# Altium schematic sheet [17] - LVDS, CSI, LCD, TSC.SchDoc
size A2; DocumentNumber: 17; SheetNumber: 17; SheetTotal: 31
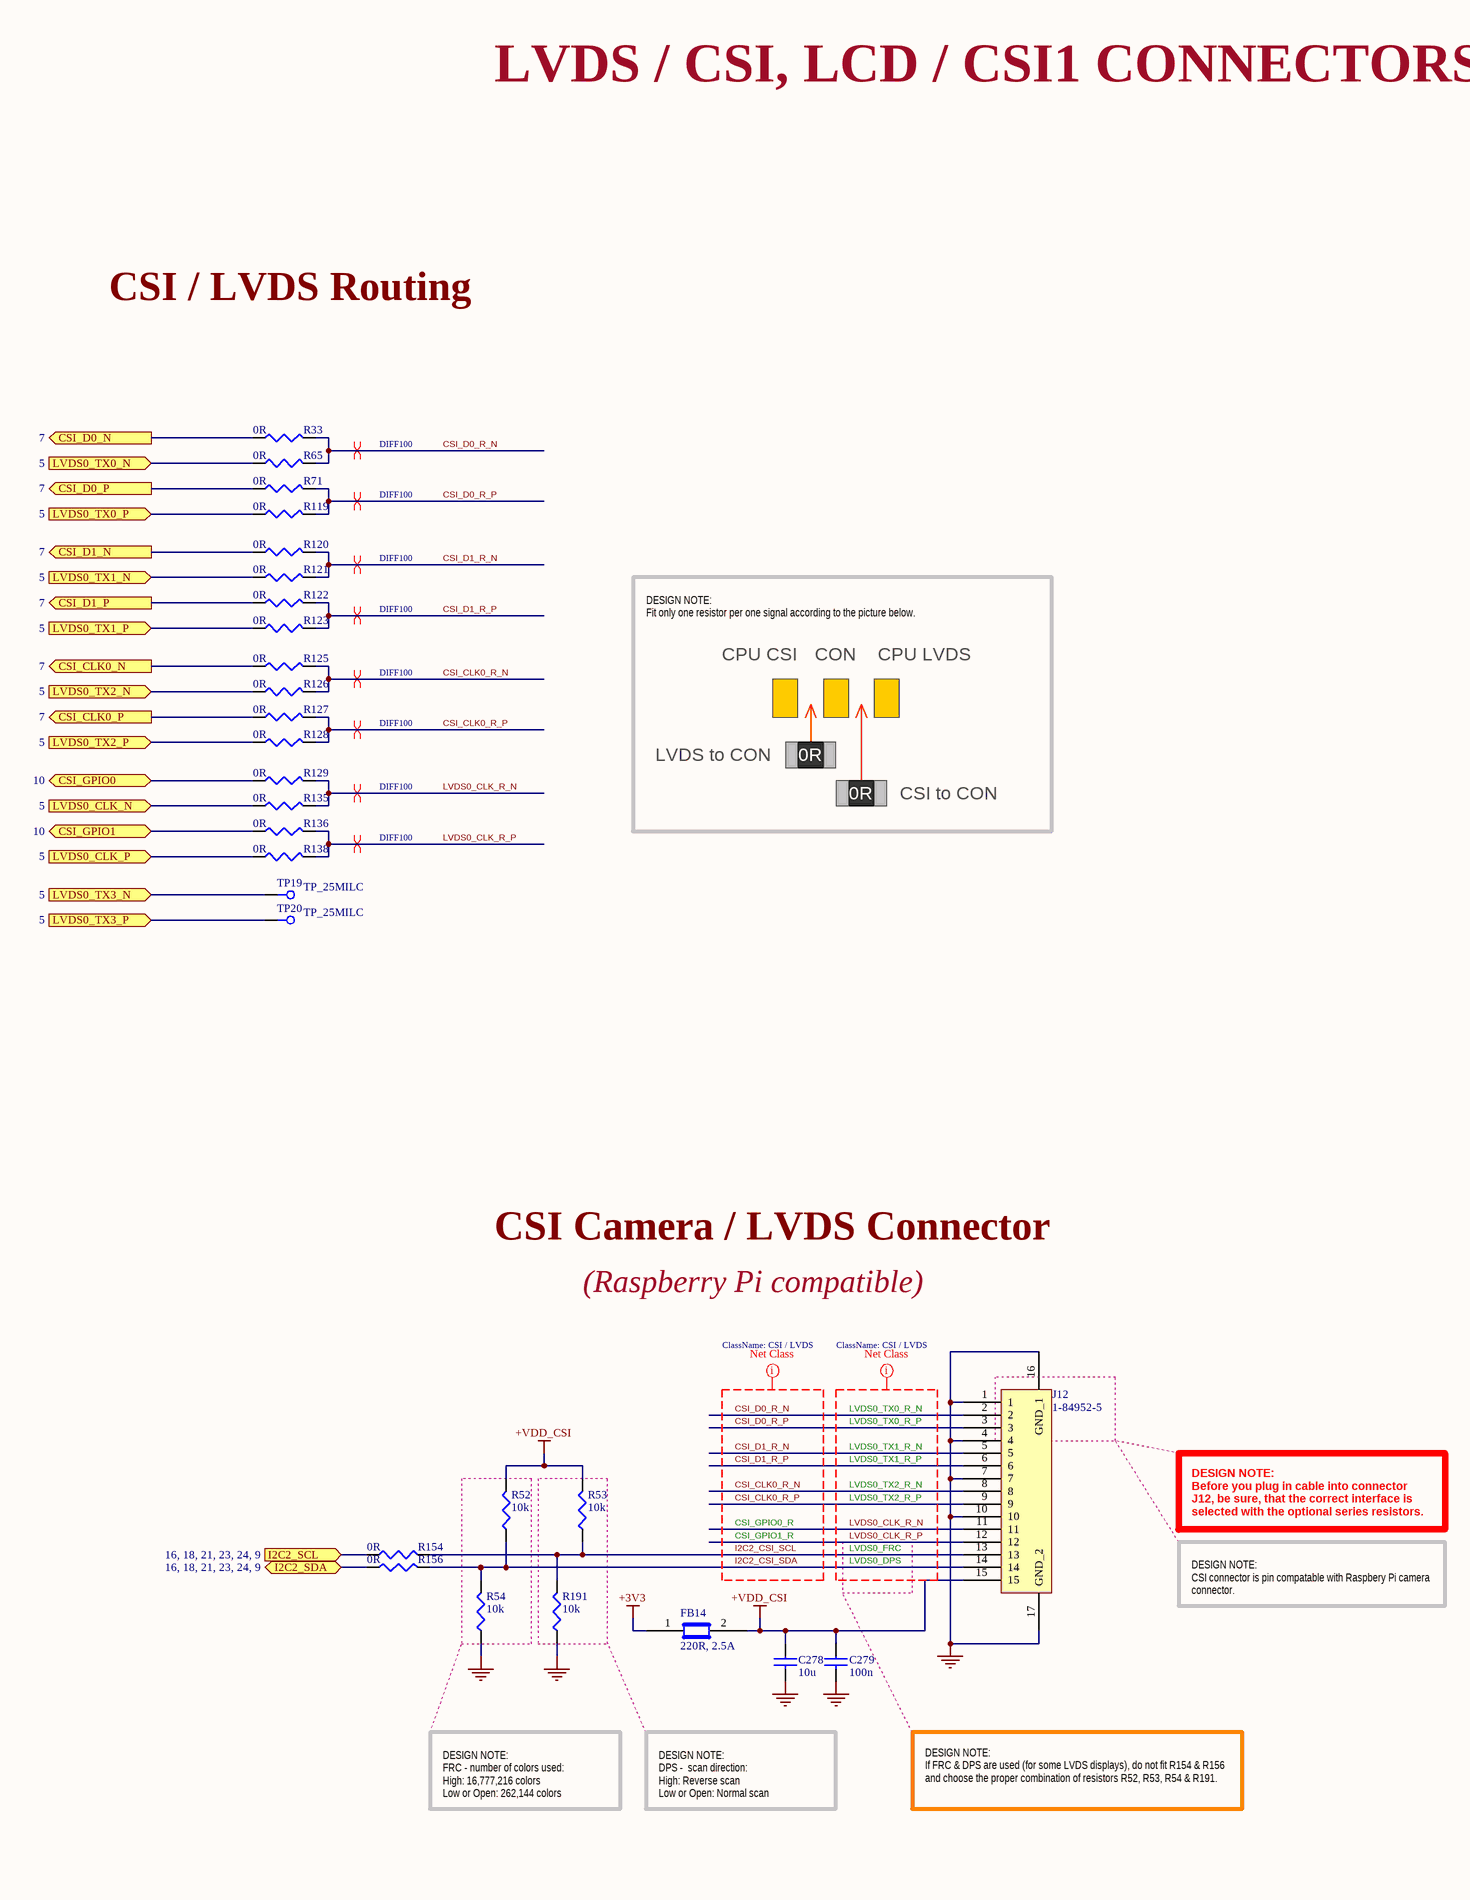
[diagram p0: [17] - LVDS, CSI, LCD, TSC.SchDoc, left]
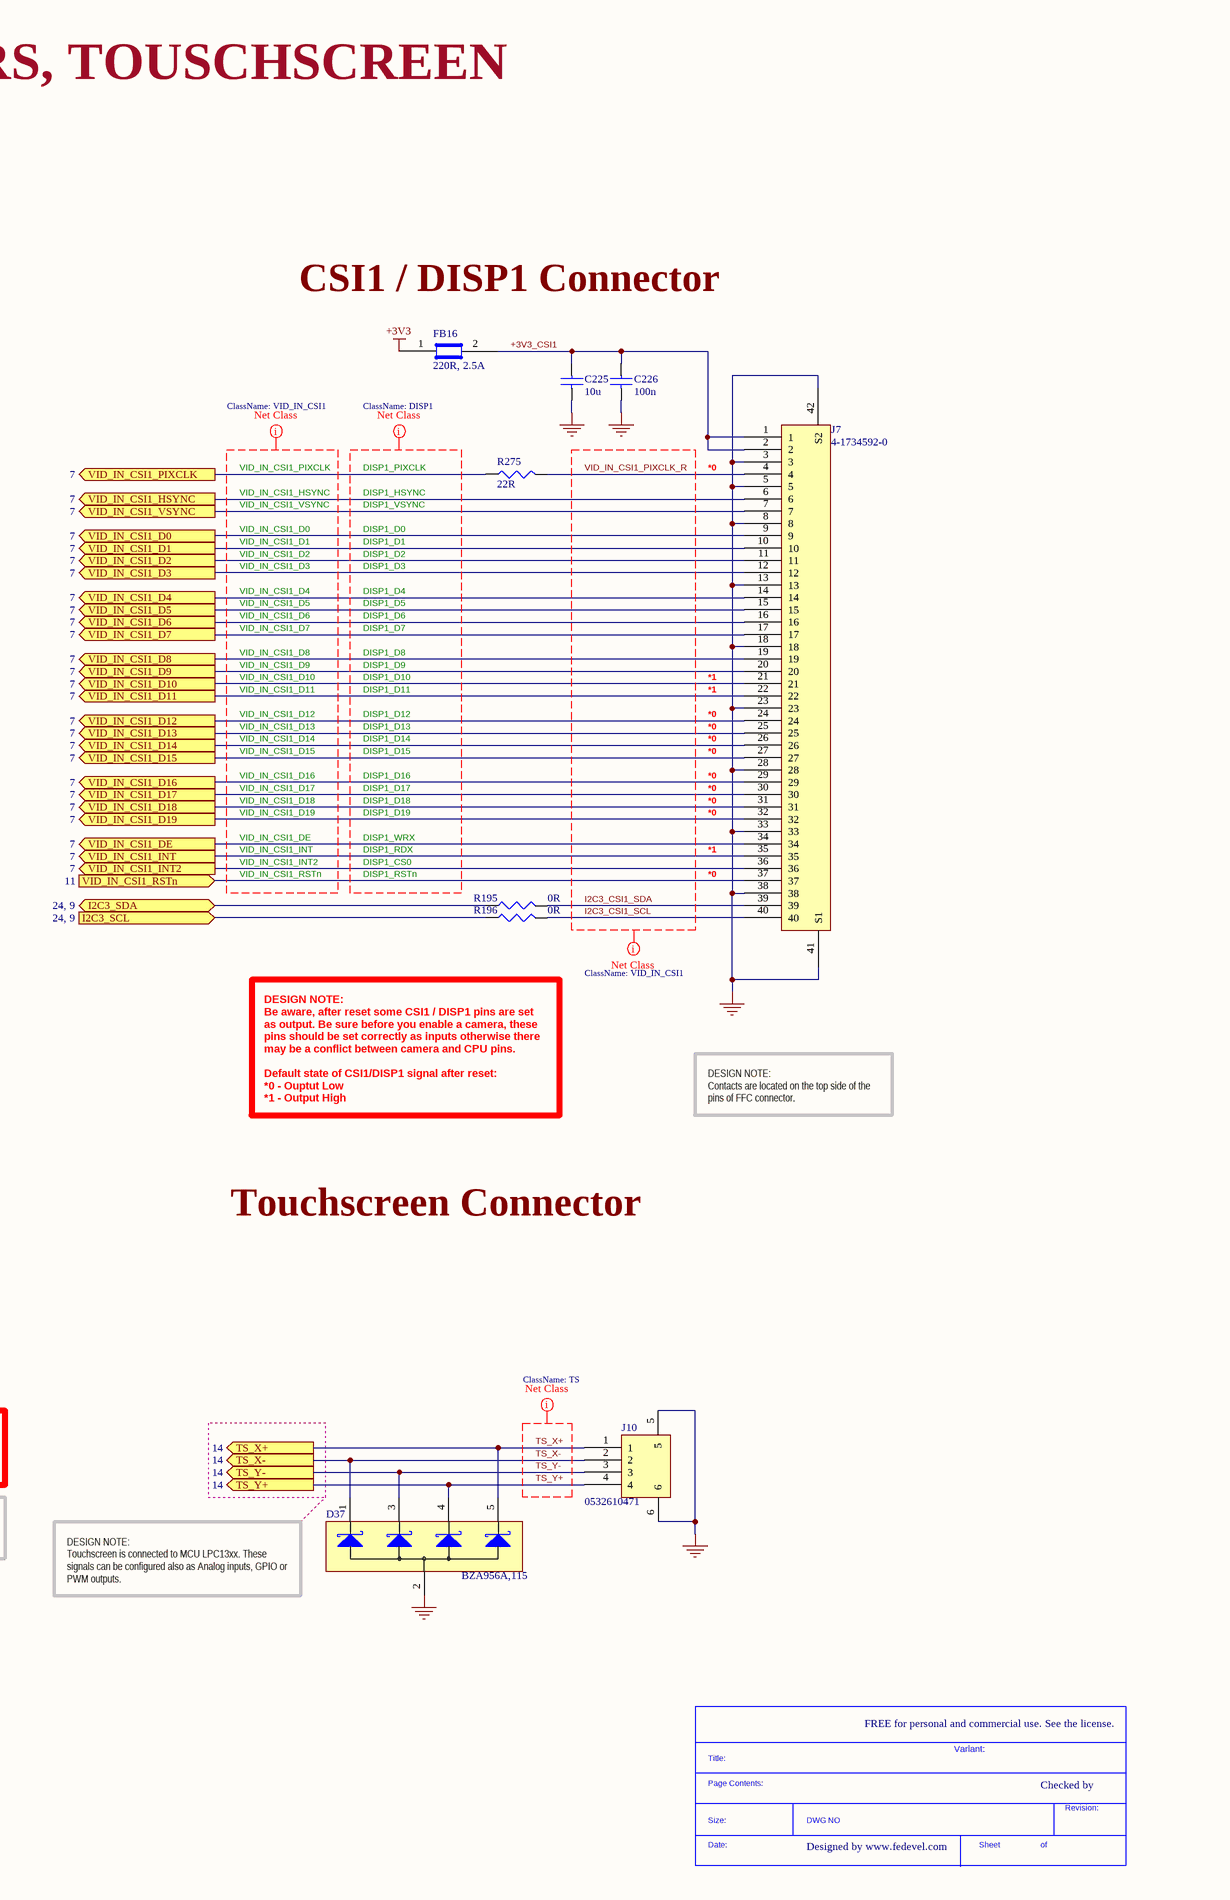
[diagram p1: [17] - LVDS, CSI, LCD, TSC.SchDoc, right]

## Parts
*  SDTitleBlock  (value not drawn)  (graphical)
C225  10u  [C0603]
C226  100n  [C0402]
C278  10u  [C0603]
C279  100n  [C0402]
D37  BZA956A,115  [SOT665]
FB14  220R, 2.5A  [C0603]
FB16  220R, 2.5A  [C0603]
J7  4-1734592-0  [4-1734592-0]
J10  0532610471  [0532610471]
J12  1-84952-5  [ZIF_RA_BOTTOM_15x1mm]
R33  0R  [R0402]
R52  10k  [R0402]
R53  10k  [R0402]
R54  10k  [R0402]
R65  0R  [R0402]
R71  0R  [R0402]
R119  0R  [R0402]
R120  0R  [R0402]
R121  0R  [R0402]
R122  0R  [R0402]
R123  0R  [R0402]
R125  0R  [R0402]
R126  0R  [R0402]
R127  0R  [R0402]
R128  0R  [R0402]
R129  0R  [R0402]
R135  0R  [R0402]
R136  0R  [R0402]
R138  0R  [R0402]
R154  0R  [R0402]
R156  0R  [R0402]
R191  10k  [R0402]
R195  0R  [R0402]
R196  0R  [R0402]
R275  22R  [R0402]
TP19  TP_25MILC  [TP_25C]  (no BOM)
TP20  TP_25MILC  [TP_25C]  (no BOM)

## Ports
CSI_CLK0_N (out, see 7), CSI_CLK0_P (out, see 7), CSI_D0_N (out, see 7), CSI_D0_P (out, see 7), CSI_D1_N (out, see 7), CSI_D1_P (out, see 7), CSI_GPIO0 (bidir, see 10), CSI_GPIO1 (bidir, see 10), I2C2_SCL (see 16, 18, 21, 23, 24, 9), I2C2_SDA (bidir, see 16, 18, 21, 23, 24, 9), I2C3_SCL (see 24, 9), I2C3_SDA (bidir, see 24, 9), LVDS0_CLK_N (in, see 5), LVDS0_CLK_P (in, see 5), LVDS0_TX0_N (in, see 5), LVDS0_TX0_P (in, see 5), LVDS0_TX1_N (in, see 5), LVDS0_TX1_P (in, see 5), LVDS0_TX2_N (in, see 5), LVDS0_TX2_P (in, see 5), LVDS0_TX3_N (in, see 5), LVDS0_TX3_P (in, see 5), TS_X+ (out, see 14), TS_X- (out, see 14), TS_Y+ (out, see 14), TS_Y- (out, see 14), VID_IN_CSI1_D0 (out, see 7), VID_IN_CSI1_D1 (out, see 7), VID_IN_CSI1_D2 (out, see 7), VID_IN_CSI1_D3 (out, see 7), VID_IN_CSI1_D4 (out, see 7), VID_IN_CSI1_D5 (out, see 7), VID_IN_CSI1_D6 (out, see 7), VID_IN_CSI1_D7 (out, see 7), VID_IN_CSI1_D8 (out, see 7), VID_IN_CSI1_D9 (out, see 7), VID_IN_CSI1_D10 (out, see 7), VID_IN_CSI1_D11 (out, see 7), VID_IN_CSI1_D12 (out, see 7), VID_IN_CSI1_D13 (out, see 7), VID_IN_CSI1_D14 (out, see 7), VID_IN_CSI1_D15 (out, see 7), VID_IN_CSI1_D16 (out, see 7), VID_IN_CSI1_D17 (out, see 7), VID_IN_CSI1_D18 (out, see 7), VID_IN_CSI1_D19 (out, see 7), VID_IN_CSI1_DE (out, see 7), VID_IN_CSI1_HSYNC (out, see 7), VID_IN_CSI1_INT2 (out, see 7), VID_IN_CSI1_INT (out, see 7), VID_IN_CSI1_PIXCLK (out, see 7), VID_IN_CSI1_RSTn (in, see 11), VID_IN_CSI1_VSYNC (out, see 7)

## Nets
+3V3: FB14.1 FB16.1
+VDD_CSI: C278.1 C279.1 FB14.2 J12.15 R52.2 R53.2
GND: C225.2 C226.2 C278.2 C279.2 D37.2 J7.3 J7.5 J7.8 J7.13 J7.18 J7.23 J7.28 J7.33 J7.38 J7.41(S1) J7.42(S2) J10.5 J10.6 J12.1 J12.4 J12.7 J12.10 J12.16(GND_1) J12.17(GND_2) R54.1 R191.1
+3V3_CSI1: C225.1 C226.1 FB16.2 J7.1 J7.2
CSI_CLK0_N: R125.1 ; port CSI_CLK0_N
CSI_CLK0_P: R127.1 ; port CSI_CLK0_P
CSI_CLK0_R_N: J12.8 R125.2 R126.2
CSI_CLK0_R_P: J12.9 R127.2 R128.2
CSI_D0_N: R33.1 ; port CSI_D0_N
CSI_D0_P: R71.1 ; port CSI_D0_P
CSI_D0_R_N: J12.2 R33.2 R65.2
CSI_D0_R_P: J12.3 R71.2 R119.2
CSI_D1_N: R120.1 ; port CSI_D1_N
CSI_D1_P: R122.1 ; port CSI_D1_P
CSI_D1_R_N: J12.5 R120.2 R121.2
CSI_D1_R_P: J12.6 R122.2 R123.2
CSI_GPIO0: R129.1 ; port CSI_GPIO0
CSI_GPIO1: R136.1 ; port CSI_GPIO1
I2C2_CSI_SCL: J12.13 R53.1 R154.2 R191.2
I2C2_CSI_SDA: J12.14 R52.1 R54.2 R156.2
I2C2_SCL: R154.1 ; port I2C2_SCL
I2C2_SDA: R156.1 ; port I2C2_SDA
I2C3_CSI1_SCL: J7.40 R196.1
I2C3_CSI1_SDA: J7.39 R195.1
I2C3_SCL: R196.2 ; port I2C3_SCL
I2C3_SDA: R195.2 ; port I2C3_SDA
LVDS0_CLK_N: R135.1 ; port LVDS0_CLK_N
LVDS0_CLK_P: R138.1 ; port LVDS0_CLK_P
LVDS0_CLK_R_N: J12.11 R129.2 R135.2
LVDS0_CLK_R_P: J12.12 R136.2 R138.2
LVDS0_TX0_N: R65.1 ; port LVDS0_TX0_N
LVDS0_TX0_P: R119.1 ; port LVDS0_TX0_P
LVDS0_TX1_N: R121.1 ; port LVDS0_TX1_N
LVDS0_TX1_P: R123.1 ; port LVDS0_TX1_P
LVDS0_TX2_N: R126.1 ; port LVDS0_TX2_N
LVDS0_TX2_P: R128.1 ; port LVDS0_TX2_P
LVDS0_TX3_N: TP19.1 ; port LVDS0_TX3_N
LVDS0_TX3_P: TP20.1 ; port LVDS0_TX3_P
TS_X+: D37.5 J10.1 ; port TS_X+
TS_X-: D37.1 J10.2 ; port TS_X-
TS_Y+: D37.4 J10.4 ; port TS_Y+
TS_Y-: D37.3 J10.3 ; port TS_Y-
VID_IN_CSI1_D0: J7.9 ; port VID_IN_CSI1_D0
VID_IN_CSI1_D1: J7.10 ; port VID_IN_CSI1_D1
VID_IN_CSI1_D2: J7.11 ; port VID_IN_CSI1_D2
VID_IN_CSI1_D3: J7.12 ; port VID_IN_CSI1_D3
VID_IN_CSI1_D4: J7.14 ; port VID_IN_CSI1_D4
VID_IN_CSI1_D5: J7.15 ; port VID_IN_CSI1_D5
VID_IN_CSI1_D6: J7.16 ; port VID_IN_CSI1_D6
VID_IN_CSI1_D7: J7.17 ; port VID_IN_CSI1_D7
VID_IN_CSI1_D8: J7.19 ; port VID_IN_CSI1_D8
VID_IN_CSI1_D9: J7.20 ; port VID_IN_CSI1_D9
VID_IN_CSI1_D10: J7.21 ; port VID_IN_CSI1_D10
VID_IN_CSI1_D11: J7.22 ; port VID_IN_CSI1_D11
VID_IN_CSI1_D12: J7.24 ; port VID_IN_CSI1_D12
VID_IN_CSI1_D13: J7.25 ; port VID_IN_CSI1_D13
VID_IN_CSI1_D14: J7.26 ; port VID_IN_CSI1_D14
VID_IN_CSI1_D15: J7.27 ; port VID_IN_CSI1_D15
VID_IN_CSI1_D16: J7.29 ; port VID_IN_CSI1_D16
VID_IN_CSI1_D17: J7.30 ; port VID_IN_CSI1_D17
VID_IN_CSI1_D18: J7.31 ; port VID_IN_CSI1_D18
VID_IN_CSI1_D19: J7.32 ; port VID_IN_CSI1_D19
VID_IN_CSI1_DE: J7.34 ; port VID_IN_CSI1_DE
VID_IN_CSI1_HSYNC: J7.6 ; port VID_IN_CSI1_HSYNC
VID_IN_CSI1_INT: J7.35 ; port VID_IN_CSI1_INT
VID_IN_CSI1_INT2: J7.36 ; port VID_IN_CSI1_INT2
VID_IN_CSI1_PIXCLK: R275.1 ; port VID_IN_CSI1_PIXCLK
VID_IN_CSI1_PIXCLK_R: J7.4 R275.2
VID_IN_CSI1_RSTn: J7.37 ; port VID_IN_CSI1_RSTn
VID_IN_CSI1_VSYNC: J7.7 ; port VID_IN_CSI1_VSYNC

## Layout directives
net class DISP1: (no net found under the mark)
net class VID_IN_CSI1: (no net found under the mark), I2C3_CSI1_SCL, I2C3_CSI1_SDA, VID_IN_CSI1_PIXCLK_R
differential pair; net class DIFF100: CSI_CLK0_R_N, CSI_CLK0_R_P, CSI_D0_R_N, CSI_D0_R_P, CSI_D1_R_N, CSI_D1_R_P, LVDS0_CLK_R_N, LVDS0_CLK_R_P
net class TS: TS_X+, TS_X-, TS_Y+, TS_Y-
net class CSI / LVDS: CSI_CLK0_R_N, CSI_CLK0_R_P, CSI_D0_R_N, CSI_D0_R_P, CSI_D1_R_N, CSI_D1_R_P, I2C2_CSI_SCL, I2C2_CSI_SDA, LVDS0_CLK_R_N, LVDS0_CLK_R_P

## Notes on the sheet
- LVDS / CSI, LCD / CSI1 CONNECTORS, TOUSCHSCREEN
- CSI / LVDS Routing
- CSI1 / DISP1 Connector
- VID_IN_CSI1_HSYNC
- VID_IN_CSI1_VSYNC
- VID_IN_CSI1_PIXCLK
- DISP1_PIXCLK
- DISP1_HSYNC
- DISP1_VSYNC
- *0
- VID_IN_CSI1_D0
- VID_IN_CSI1_D1
- VID_IN_CSI1_D2
- VID_IN_CSI1_D3
- DISP1_D0
- DISP1_D1
- DISP1_D2
- DISP1_D3
- DESIGN NOTE:
  Fit only one resistor per one signal according to the picture below.
- VID_IN_CSI1_D4
- VID_IN_CSI1_D5
- VID_IN_CSI1_D6
- VID_IN_CSI1_D7
- DISP1_D4
- DISP1_D5
- DISP1_D6
- DISP1_D7
- CPU CSI
- CON
- CPU LVDS
- VID_IN_CSI1_D8
- VID_IN_CSI1_D9
- VID_IN_CSI1_D10
- VID_IN_CSI1_D11
- DISP1_D8
- DISP1_D9
- DISP1_D10
- DISP1_D11
- *1
- LVDS to CON
- 0R
- VID_IN_CSI1_D12
- VID_IN_CSI1_D13
- VID_IN_CSI1_D14
- VID_IN_CSI1_D15
- DISP1_D12
- DISP1_D13
- DISP1_D14
- DISP1_D15
- CSI to CON
- VID_IN_CSI1_D16
- VID_IN_CSI1_D17
- VID_IN_CSI1_D18
- VID_IN_CSI1_D19
- DISP1_D16
- DISP1_D17
- DISP1_D18
- DISP1_D19
- VID_IN_CSI1_RSTn
- VID_IN_CSI1_INT
- VID_IN_CSI1_DE
- VID_IN_CSI1_INT2
- DISP1_RSTn
- DISP1_RDX
- DISP1_WRX
- DISP1_CS0
- DESIGN NOTE:
  Be aware, after reset some CSI1 / DISP1 pins are set as output. Be sure before you enable a camera, these pins should be set correctly as inputs otherwise there may be a conflict between camera and CPU pins.
  Default state of CSI1/DISP1 signal after reset:
  *0 - Ouptut Low
  *1 - Output High
- DESIGN NOTE:
  Contacts are located on the top side of the pins of FFC connector.
- CSI Camera / LVDS Connector
- Touchscreen Connector
- (Raspberry Pi compatible)
- LVDS0_TX0_R_N
- LVDS0_TX1_R_N
- LVDS0_TX0_R_P
- LVDS0_TX1_R_P
- CSI_GPIO1_R
- CSI_GPIO0_R
- LVDS0_TX2_R_P
- LVDS0_TX2_R_N
- DESIGN NOTE:
  Before you plug in cable into connector J12, be sure, that the correct interface is selected with the optional series resistors.
- LVDS0_DPS
- LVDS0_FRC
- DESIGN NOTE:
  CSI connector is pin compatable with Raspbery Pi camera connector.
- DESIGN NOTE:
  Touchscreen is connected to MCU LPC13xx. These signals can be configured also as Analog inputs, GPIO or PWM outputs.
- FREE for personal and commercial use. See the license.
- DESIGN NOTE:
  FRC - number of colors used:
  High: 16,777,216 colors
  Low or Open: 262,144 colors
- DESIGN NOTE:
  DPS -  scan direction:
  High: Reverse scan
  Low or Open: Normal scan
- DESIGN NOTE:
  If FRC & DPS are used (for some LVDS displays), do not fit R154 & R156 and choose the proper combination of resistors R52, R53, R54 & R191.
- Variant:
- Checked by
- Designed by www.fedevel.com
- (in symbol SDTitleBlock) Title:; Page Contents:; Revision:; Size:; DWG NO; Date:; Sheet; of

## Library data of the parts
C225 C278 = C1608X5R0J106M: CAP CER 10UF 6.3V X5R 20% 0603; Manufacturer: TDK Corporation; Capacitance: 10µF; Value: 10µF; .Checked PCB: used; Category: Capacitors; Supplier Part Number: 445-4112-1-ND; Manufacturer Part Number: C1608X5R0J106M; Operating Temperature: -55°C ~ 85°C; Package / Case: 0603 (1608 Metric); Price 1k [$]: 0.08580; .Checked SCH: used; Voltage - Rated: 6.3V; Features: Low ESR; Supplier: Digikey; Supplier 1: Digi-Key; Supplier Part Number 1: 445-4112-1-ND; RoHS: RoHS Compliant; Stock 1: 48157; Pricing 1: 1=0.46, 10=0.363, 100=0.1898, 250=0.14024, 500=0.1089, 1000=0.0858 (USD); Tolerance: ±20%; Temperature Coefficient: X5R; Mounting Type: Surface Mount, MLCC; Applications: General Purpose; Ratings: -; Size / Dimension: 0.063" L x 0.031" W (1.60mm x 0.80mm); Height - Seated (Max): -; Thickness (Max): 0.037" (0.95mm); Lead Spacing: -; Packaging: Cut Tape (CT); Lead Style: -; ComponentLink1URL: http://www.tdk.com/pdf/general_B11.pdf; ComponentLink1Description: http://www.tdk.com/pdf/general_B11.pdf
C226 C279 = C1005X5R1H104K: CAP CER .10UF 50V X5R 10% 0402; Manufacturer: TDK Corporation; Capacitance: 0.1µF; Value: 100nF; .Checked PCB: used; Category: Capacitors; Supplier Part Number: 445-5942-1-ND; Manufacturer Part Number: C1005X5R1H104K; Operating Temperature: -55°C ~ 85°C; Package / Case: 0402 (1005 Metric); Price 1k [$]: 0.02340; .Checked SCH: used; Voltage - Rated: 50V; Supplier: Digikey; Supplier 1: Digi-Key; Supplier Part Number 1: 445-5942-1-ND; RoHS: RoHS Compliant; Stock 1: 106926; Pricing 1: 1=0.27, 10=0.18, 100=0.072, 250=0.05176, 500=0.0369, 1000=0.027 (USD); Tolerance: ±10%; Temperature Coefficient: X5R; Mounting Type: Surface Mount, MLCC; Applications: General Purpose; Ratings: -; Size / Dimension: 0.039" L x 0.020" W (1.00mm x 0.50mm); Height - Seated (Max): -; Thickness (Max): 0.022" (0.55mm); Lead Spacing: -; Features: -; Packaging: Cut Tape (CT); Lead Style: -; ComponentLink1URL: http://www.tdk.co.jp/tefe02/e412_c.pdf; ComponentLink1Description: http://www.tdk.co.jp/tefe02/e412_c.pdf
D37 = BZA956A,115: TVS ZENER QUAD 5.6V SOT665; Manufacturer: NXP Semiconductors; Voltage - Reverse Standoff (Typ): 3V; Voltage - Breakdown: 5.32V; Power (Watts): 16W; Polarization: 4 Channel Array - Unidirectional; .Creator: MM; .Checked PCB: used; Supplier 1: Digi-Key; Manufacturer Part Number: BZA956A,115; RoHS: RoHS Compliant; Category: Circuit Protection; Stock 1: 7740; Pricing 1: 1=0.55, 10=0.386, 25=0.3176, 100=0.2537, 250=0.1848, 500=0.15008, 1000=0.11536 (USD); Packaging: Cut Tape (CT); Mounting Type: Surface Mount; Package / Case: SOT-665; Supplier Device Package: SOT-665; ComponentLink1URL: http://www.nxp.com/documents/data_sheet/BZA900A_SERIES.pdf; ComponentLink1Description: http://www.nxp.com/documents/data_sheet/BZA900A_SERIES.pdf; Supplier Part Number 1: 568-7016-1-ND; .Checked SCH: used
FB14 FB16 = BLM18SG221TN1D: FERRITE CHIP 220 OHM 2500MA 0603; Manufacturer: Murata Electronics North America; Impedance @ Frequency: 220 Ohm @ 100MHz; DC Resistance (DCR): 40 mOhm Max; Filter Type: Differential Mode - Single; Number of Lines: 1; .Checked PCB: used; Supplier 1: Digi-Key; Supplier Part Number 1: 490-5225-1-ND; Manufacturer Part Number: BLM18SG221TN1D; RoHS: RoHS Compliant; Category: Filters; Stock 1: 54640; Pricing 1: 1=0.38, 10=0.282, 50=0.1646, 100=0.1316, 250=0.094, 500=0.06392, 1000=0.0517, 5000=0.04042 (USD); Current Rating: 2.5A; Package / Case: 0603 (1608 Metric); Mounting Type: Surface Mount; Packaging: Cut Tape (CT); Height (Max): 0.037" (0.95mm); Size / Dimension: 0.063" L x 0.031" W (1.60mm x 0.80mm); ComponentLink1URL: http://search.murata.co.jp/Ceramy/image/img/PDF/ENG/L0110S0100BLM18S.pdf; ComponentLink1Description: http://search.murata.co.jp/Ceramy/image/img/PDF/ENG/L0110S0100BLM18S.pdf; .Checked SCH: used
J7 = 4-1734592-0: CONN FPC BOTTOM 40POS 0.50MM R/A; Manufacturer: TE Connectivity; Connector/Contact Type: Contacts, Bottom; Number of Positions: 40; Pitch: 0.020" (0.50mm); FFC, FCB Thickness: 0.30mm; Locking Feature: Slide Lock; Cable End Type: Tapered; Actuator Material: Thermoplastic; Voltage Rating: 250V; Material Flammability Rating: UL94 V-0; Current Rating: 0.5A; .Creator: MM; Supplier 1: Digi-Key; Manufacturer Part Number: 4-1734592-0; RoHS: RoHS Compliant; Category: Connectors, Interconnects; Stock 1: 8552; Pricing 1: 1=1.31, 10=1.154, 25=1.0864, 50=1.0412, 100=0.9959, 250=0.90536, 500=0.81482, 1000=0.72429 (USD); Packaging: Cut Tape (CT); Flat Flex Type: FPC; Mounting Type: Surface Mount, Right Angle; Termination: Solder; Height Above Board: 0.081" (2.05mm); Contact Material: Phosphor Bronze; Contact Finish: Gold; Housing Material: Liquid Crystal Polymer (LCP); Features: Solder Retention, Zero Insertion Force (ZIF); Operating Temperature: -40°C ~ 85°C; ComponentLink1URL: http://www.te.com/commerce/DocumentDelivery/DDEController?Action=srchrtrv&DocNm=1734592&DocType=Customer+Drawing&DocLang=English; ComponentLink1Description: http://www.te.com/commerce/DocumentDelivery/DDEController?Action=srchrtrv&DocNm=1734592&DocType=Customer+Drawing&DocLang=English; Supplier Part Number 1: A100226CT-ND; .Checked PCB: MM; .Checked SCH: MM
J10 = 0532610471: CONN HEADER 4POS 1.25MM R/A SMD; Manufacturer: Molex Inc; Connector Type: Header, Shrouded; Number of Positions: 4; Number of Positions Loaded: All; Pitch: 0.049" (1.25mm); .Creator: MM; .Checked PCB: used; Supplier 1: Digi-Key; Manufacturer Part Number: 0532610471; RoHS: RoHS Compliant; Category: Connectors, Interconnects; Stock 1: 9616; Pricing 1: 1=1.5, 10=1.318, 25=1.2404, 50=1.1888, 100=1.1372, 250=1.0338, 500=0.9304 (USD); Packaging: Cut Tape (CT); Contact Type: Blade Pin; Number of Rows: 1; Row Spacing: -; Contact Mating Length: -; Mounting Type: Surface Mount, Right Angle; Termination: Solder; Fastening Type: -; Features: Solder Retention; Contact Finish: Tin; Contact Finish Thickness: 39µin (1.00µm); Color: Natural; ComponentLink1URL: http://www.molex.com/pdm_docs/sd/532610471_sd.pdf; ComponentLink1Description: http://www.molex.com/pdm_docs/sd/532610471_sd.pdf; Supplier Part Number 1: WM7622CT-ND; .Checked SCH: used
J12 = 1-84952-5: CONN FPC BOTTOM 15POS 1.00MM R/A; Manufacturer: TE Connectivity; Connector/Contact Type: Contacts, Bottom; Number of Positions: 15; Pitch: 0.039" (1.00mm); FFC, FCB Thickness: 0.30mm; Locking Feature: Slide Lock; Cable End Type: Straight; Actuator Material: Polyamide (PA), Nylon, Glass Filled; Voltage Rating: 200V; Material Flammability Rating: UL94 V-0; Current Rating: 1A; .Creator: MM; Supplier 1: Digi-Key; Manufacturer Part Number: 1-84952-5; RoHS: RoHS Compliant; Category: Connectors, Interconnects; Stock 1: 3321; Pricing 1: 1=2.32, 10=2.107, 25=1.9776, 50=1.8918, 100=1.8057, 250=1.63376, 500=1.50478 (USD); Packaging: Cut Tape (CT); Flat Flex Type: FPC; Mounting Type: Surface Mount, Right Angle; Termination: Solder; Height Above Board: 0.101" (2.56mm); Contact Material: Phosphor Bronze; Contact Finish: Tin; Housing Material: Liquid Crystal Polymer (LCP), Glass Filled; Features: Solder Retention, Zero Insertion Force (ZIF); Operating Temperature: -40°C ~ 85°C; ComponentLink1URL: http://www.te.com/commerce/DocumentDelivery/DDEController?Action=srchrtrv&DocNm=84952&DocType=Customer+Drawing&DocLang=English; ComponentLink1Description: http://www.te.com/commerce/DocumentDelivery/DDEController?Action=srchrtrv&DocNm=84952&DocType=Customer+Drawing&DocLang=English; Supplier Part Number 1: A101391CT-ND; .Checked PCB: MM; .Checked SCH: MM
R33 R65 R71 R119-R123 R125-R129 R135 R136 R138 R154 R156 R195 R196 = RC0402JR-070RL: RES 0.0 OHM 1/16W 0402 SMD; Manufacturer: Yageo; Resistance (Ohms): 0.0; Power (Watts): 0.063W, 1/16W; Tolerance: Jumper; .Checked PCB: used; Category: Resistors; Manufacturer Part Number: RC0402JR-070RL; Package / Case: 0402 (1005 Metric); Price 1k [$]: 0.01389; Value: 0R; .Checked SCH: used; Supplier Part Number: 311-0.0JRCT-ND; Supplier: Digikey; Supplier 1: Digi-Key; Supplier Part Number 1: 311-0.0JRCT-ND; RoHS: RoHS Compliant; Stock 1: 1106330; Pricing 1: 10=0.012, 50=0.009, 100=0.0069, 250=0.00512, 500=0.0038, 1000=0.00253 (USD); Composition: Thick Film; Features: -; Temperature Coefficient: -; Size / Dimension: 0.039" L x 0.020" W (1.00mm x 0.50mm); Height: 0.016" (0.40mm); Number of Terminations: 2; Packaging: Cut Tape (CT); ComponentLink1URL: http://www.yageo.com/documents/recent/PYu-RC0402_51_RoHS_L_6.pdf; ComponentLink1Description: http://www.yageo.com/documents/recent/PYu-RC0402_51_RoHS_L_6.pdf
R52-R54 R191 = RC0402FR-0710KL: RES 10.0K OHM 1/16W 1% 0402 SMD; Manufacturer: Yageo; Power (Watts): 0.063W, 1/16W; .Checked PCB: used; Temperature Coefficient: ±100ppm/°C; Category: Resistors; Supplier Part Number: 311-10.0KLRCT-ND; Manufacturer Part Number: RC0402FR-0710KL; Package / Case: 0402 (1005 Metric); Price 1k [$]: 0.01421; Resistance (Ohms): 10K; Tolerance: ±1%; Value: 10k; .Checked SCH: used; Supplier: Digikey; Supplier 1: Digi-Key; Supplier Part Number 1: 311-10.0KLRCT-ND; RoHS: RoHS Compliant; Stock 1: 2916495; Pricing 1: 10=0.014, 50=0.0104, 100=0.0079, 250=0.00584, 500=0.00432, 1000=0.00288 (USD); Composition: Thick Film; Features: -; Size / Dimension: 0.039" L x 0.020" W (1.00mm x 0.50mm); Height: 0.016" (0.40mm); Number of Terminations: 2; Packaging: Cut Tape (CT); ComponentLink1URL: http://www.yageo.com/documents/recent/PYu-RC0402_51_RoHS_L_6.pdf; ComponentLink1Description: http://www.yageo.com/documents/recent/PYu-RC0402_51_RoHS_L_6.pdf
R275 = RC0402FR-0722RL: RES 22.0 OHM 1/16W 1% 0402 SMD; Manufacturer: Yageo; Resistance (Ohms): 22; Power (Watts): 0.063W, 1/16W; .Checked PCB: used; Temperature Coefficient: ±100ppm/°C; Category: Resistors; Supplier Part Number: 311-22.0LRCT-ND; Manufacturer Part Number: RC0402FR-0722RL; Package / Case: 0402 (1005 Metric); Price 1k [$]: 0.01421; Tolerance: ±1%; Value: 22R; .Checked SCH: used; Supplier: Digikey; Supplier 1: Digi-Key; Supplier Part Number 1: 311-22.0LRCT-ND; RoHS: RoHS Compliant; Stock 1: 943800; Pricing 1: 10=0.014, 50=0.0104, 100=0.0079, 250=0.00584, 500=0.00432, 1000=0.00288 (USD); Composition: Thick Film; Features: -; Size / Dimension: 0.039" L x 0.020" W (1.00mm x 0.50mm); Height: 0.016" (0.40mm); Number of Terminations: 2; Packaging: Cut Tape (CT); ComponentLink1URL: http://www.yageo.com/documents/recent/PYu-RC0402_51_RoHS_L_6.pdf; ComponentLink1Description: http://www.yageo.com/documents/recent/PYu-RC0402_51_RoHS_L_6.pdf
TP19 TP20 = TP_25MILC: Test Point 25mil